# Altium schematic sheet Sheet1.SchDoc: WULPUS PRO polyCMUT adapter
size A4; CheckedBy: Sergei Vostrikov; DrawnBy: Cedric Hirschi; Revision: 1.0; SheetNumber: 1; SheetTotal: 1; Project: WULPUS PRO polyCMUT adapter; ENG_APP_DATE: --/--/--; DSN_APP_DATE: --/--/--; CHK_APP_DATE: --/--/--
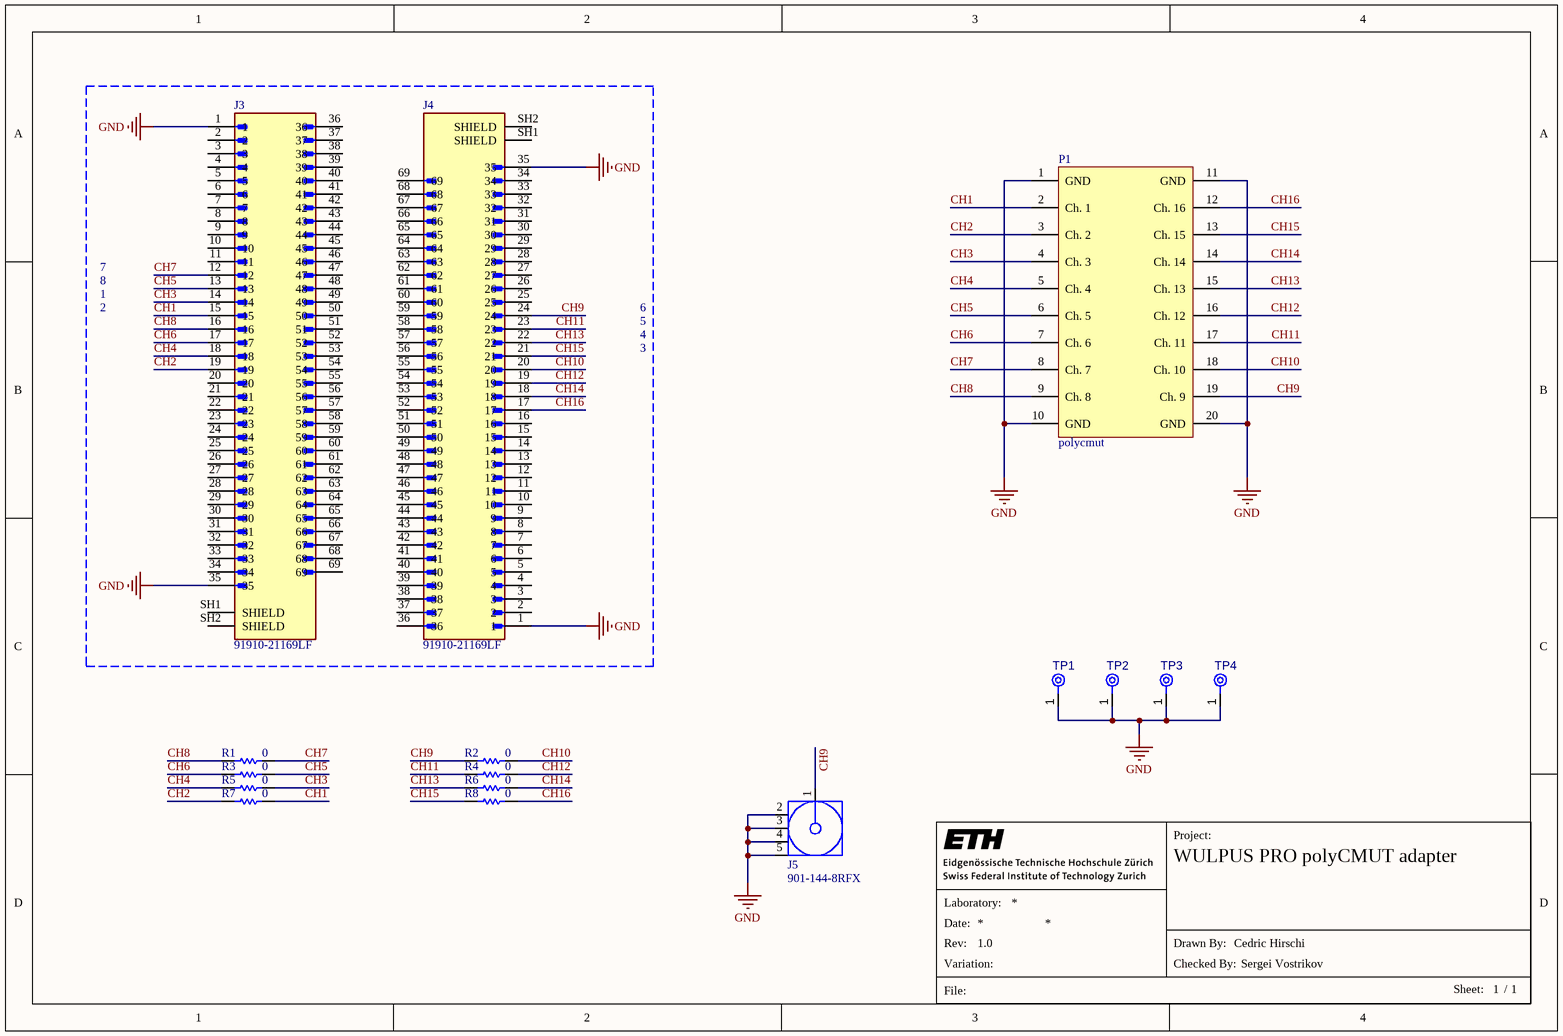
[diagram p0: Sheet1.SchDoc]

## Parts
J3  91910-21169LF  [AMPHENOL_91910-21169LF]
J4  91910-21169LF  [AMPHENOL_91910-21169LF]
J5  901-144-8RFX  [AMPH-901-144-8RFX_V]
P1  polycmut  [Interposer]
R1  0  [RESC1005X40X25NL05T10]
R2  0  [RESC1005X40X25NL05T10]
R3  0  [RESC1005X40X25NL05T10]
R4  0  [RESC1005X40X25NL05T10]
R5  0  [RESC1005X40X25NL05T10]
R6  0  [RESC1005X40X25NL05T10]
R7  0  [RESC1005X40X25NL05T10]
R8  0  [RESC1005X40X25NL05T10]
TP1  TPAD6R  [TP06R]  (value not drawn)  (no BOM)
TP2  TPAD6R  [TP06R]  (value not drawn)  (no BOM)
TP3  TPAD6R  [TP06R]  (value not drawn)  (no BOM)
TP4  TPAD6R  [TP06R]  (value not drawn)  (no BOM)

## Nets
GND: J3.1 J3.35 J4.1 J4.35 J5.2 J5.3 J5.4 J5.5 P1.1(GND) P1.10(GND) P1.11(GND) P1.20(GND) TP1.1(TP) TP2.1(TP) TP3.1(TP) TP4.1(TP)
CH1: J3.15 P1.2(Ch._1) R7.2
CH2: J3.19 P1.3(Ch._2) R7.1
CH3: J3.14 P1.4(Ch._3) R5.2
CH4: J3.18 P1.5(Ch._4) R5.1
CH5: J3.13 P1.6(Ch._5) R3.2
CH6: J3.17 P1.7(Ch._6) R3.1
CH7: J3.12 P1.8(Ch._7) R1.2
CH8: J3.16 P1.9(Ch._8) R1.1
CH9: J4.24 J5.1 P1.19(Ch._9) R2.1
CH10: J4.20 P1.18(Ch._10) R2.2
CH11: J4.23 P1.17(Ch._11) R4.1
CH12: J4.19 P1.16(Ch._12) R4.2
CH13: J4.22 P1.15(Ch._13) R6.1
CH14: J4.18 P1.14(Ch._14) R6.2
CH15: J4.21 P1.13(Ch._15) R8.1
CH16: J4.17 P1.12(Ch._16) R8.2

Not connected (* = marked no-connect by the designer): J3 2 3 4 5 6 7 8 9 10 11 20 21 22 23 24 25 26 27 28 29 30 31 32 33 34 36 37 38 39 40 41 42 43 44 45 46 47 48 49 50 51 52 53 54 55 56 57 58 59 60 61 62 63 64 65 66 67 68 69 SH1(SHIELD) SH2(SHIELD); J4 2 3 4 5 6 7 8 9 10 11 12 13 14 15 16 25 26 27 28 29 30 31 32 33 34 36 37 38 39 40 41 42 43 44 45 46 47 48 49 50 51 52 53 54 55 56 57 58 59 60 61 62 63 64 65 66 67 68 69 SH1(SHIELD) SH2(SHIELD)

## Notes on the sheet
- 7
- 8
- 1
- 2
- 6
- 5
- 4
- 3
- Project:
- Laboratory:
- Date:
- File:
- Rev:
- Variation:
- Drawn By:
- Checked By:
- Sheet:
- /

## Library data of the parts
J3 J4 = 91910-21169LF: MF: Amphenol ICC (FCI); Package: None; Price: None; Value: *; MP: 91910-21169LF; Availability: Unavailable
J5 = CMP-2000-05706-1: Coaxial Connector, 18 GHz, 50 Ohm, -65 to 165 degC, 5-Pin THD, RoHS, Bulk; Manufacturer: Amphenol; Contact Termination: Solder; Dielectric Material: Polytetrafluoroethylene(PTFE); Frequency - Max: 18GHz; Body Material: Brass; Other Names: 901-144-8-RFX9011448RFXARFX1231; Center Contact Plating: Gold; Connector Type: Jack,FemaleSocket; Center Contact Material: BerylliumCopper; Impedance: 50Ohm; 3D Model: 901-144-8RFX.igs; Online Catalog: SMA,RFX; Connector Style: SMA; Category: Connectors,Interconnects; Housing Color: Gold; Mounting Type: ThroughHole; Ingress Protection: -; Packaging: Bulk; Features: -; Fastening Type: Threaded; Series: -; Standard Package: 1; Shield Termination: Solder; Mounting Technology: SurfaceMount; Family: CoaxialConnectors(RF); Package Reference: 901-144-8RFX; Datasheet URL: https://datasheet.ciiva.com/23676/c901-144-8rfx-23676337.pdf; Package Description: 5-Pin Through Hole Device, Body 7 x 7 mm, Pitch 2.54 mm; Cable Group: -; Datasheet Version: Rev. A, 01/2001; Body Finish: Gold; Operating Temperature: -65°C~165°C; Voltage Rating: -; Manufacturer URL: http://www.amphenol.com/
R1-R8 = CMP-1011-00001-2: Manufacturer: Yageo / Phycomp; Part Number: RC0402JR-070RL
TP1-TP4 = CMP-00028-00002-2: 0.6mm round; Pins: 1